# Altium schematic sheet main.SchDoc
size A3
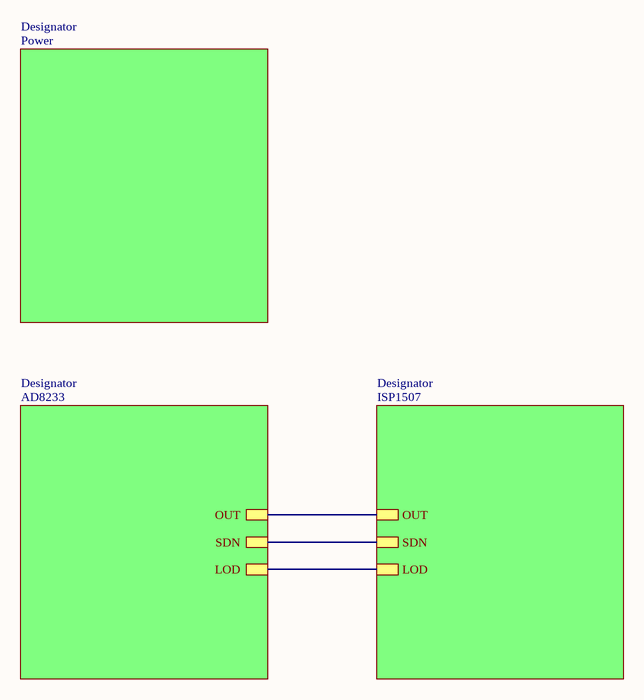
[diagram p0: main.SchDoc]

## Sub-sheets
Designator = Power: no entries
Designator = AD8233: SDN, OUT, LOD
Designator = ISP1507: OUT, SDN, LOD

## Nets
(unnamed): sheet Designator/SDN, sheet Designator/SDN
(unnamed): sheet Designator/OUT, sheet Designator/OUT
(unnamed): sheet Designator/LOD, sheet Designator/LOD